# EasyEDA Pro project ProPrj_嵌赛国赛_2025-08-15.epro, board PCB6
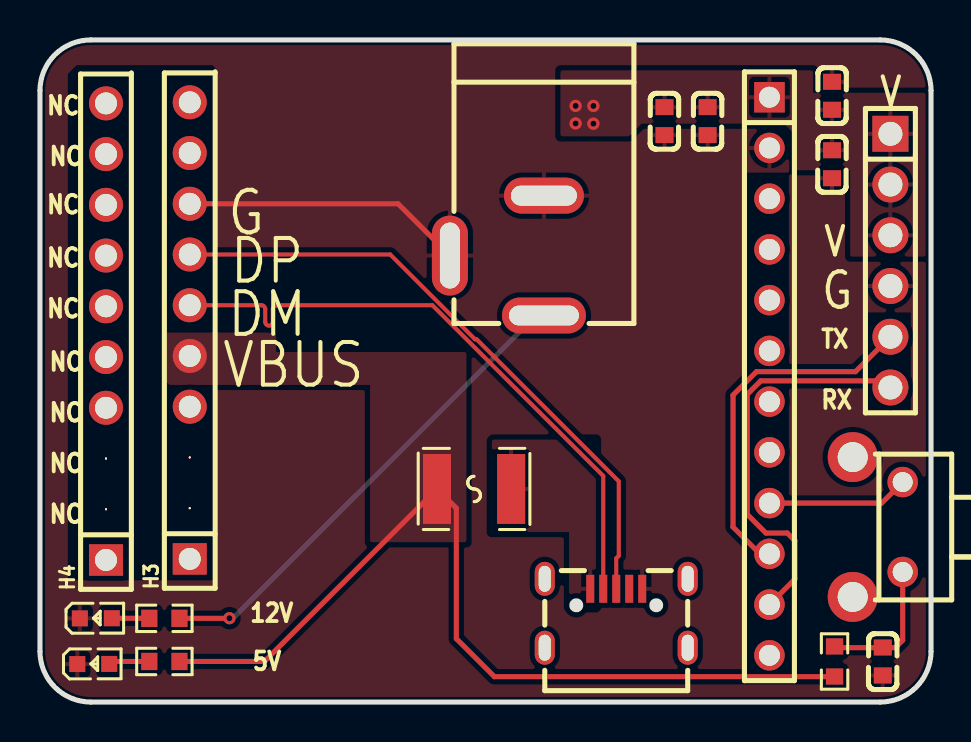
[diagram p16: board, top side]
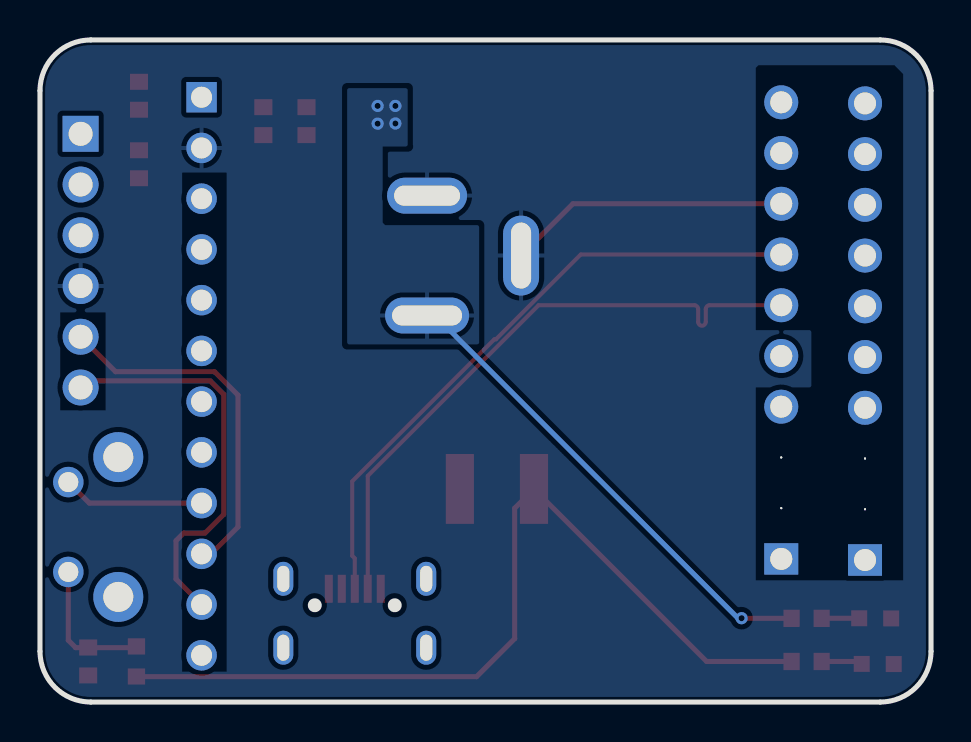
[diagram p17: board, bottom side, seen from below]

Outline 44.58 x 33.15 mm; copper layers: Top Layer, Bottom Layer. Coordinates in mm from the lower left corner of the outline.
Outline path: 0,30.61 0,2.54 arc(0.74,0.74) 2.54,0 42.04,0 arc(43.83,0.74) 44.58,2.54 44.58,30.61 arc(43.83,32.4) 42.04,33.15 2.54,33.15 arc(0.74,32.4) 0,30.61
Stack: Top Layer 0.035mm / Dielectric1 1.51mm FR4 er 4.5 / Bottom Layer 0.035mm

## Design rules (mm)
template: 自定义配置
spacing copperThickness1oz (default): track to track 0.102, other pairs 0.152 to 0.3
spacing copperThickness2oz: track to track 0.203, other pairs 0.152 to 0.3
track width copperThickness1oz (default): min 0.127, default 0.254, max 2.54
track width copperThickness2oz: min 0.203, default 0.254, max 2.54
differential pair differentialPair (default): width min 0.127, default 0.254, max 2.54; gap min 0.152, default 0.152
via viaSize (default): diameter min 0.5, default 0.61, max 10; hole min 0.3, default 0.305, max 6.3
net COMPUTER_VBUS uses 66

## Placement (name value [footprint] x y rotation side)
C1  100nF  [C0603]  33.4 29.08 90 top
C77  100nF  [C0603]  42.16 2.03 90 top
C78  10uf  [C0603]  31.24 29.08 90 top
C79  100nF  [C0603]  39.62 30.35 270 top
C80  10uf  [C0603]  39.62 26.92 90 top
DC1  DC-005-5A-2.0  [DC-IN-TH_DC-005-5A-2.0]  22.86 22.35 270 top
H2  PZ254V-11-12P  [HDR-TH_12P-P2.54-V-M]  36.49 16.31 270 top
H3  PZ254V-11-10P  [HDR-TH_10P-P2.54-V-M]  7.49 18.6 90 top
H4  PZ254V-11-10P  [HDR-TH_10P-P2.54-V-M]  3.3 18.54 90 top
H7  2.54-1x6P直针  [HDR-TH_6P-P2.54-V-M-1]  42.54 22.1 270 top
LED3  XL-1608SURC-06  [LED0603-RD_RED]  2.67 1.91 0 top
LED4  XL-1608SURC-06  [LED0603-RD_RED]  2.79 4.19 0 top
R5  10kΩ  [R0603]  6.22 2.03 180 top
R50  10kΩ  [R0603]  39.75 2.03 270 top
R51  10kΩ  [R0603]  6.22 4.19 180 top
SW18  TC-6615-5-260G  [SW-TH_4P-L7.5-W5.0-P4.50]  41.91 8.76 270 top
U41  MF-MSMF050-2  [F1812]  21.72 10.67 0 top
USB2  MICRO 4P DIP  [MINI-USB-SMD_MICRO-4P-DIP]  28.83 4.44 0 top

## Footprints (pads in the part's own frame, mm; a bottom-side part is the same pattern mirrored in y, then rotated)
C0603
  rect 0.8x0.9 smd: 1(-0.7,0) 2(0.7,0)
DC-IN-TH_DC-005-5A-2.0
  oval 1.8x4.2 hole 1x3.5: 1(3,2.352)
  oval 1.8x4 hole 1x3.3: 2(-3,2.352)
  oval 4x1.8 hole 3.3x1: 3(-0.001,-2.352)
F1812
  rect 1.407x3.499 smd: 1(-1.853,0) 2(1.853,0)
HDR-TH_6P-P2.54-V-M-1
  rect 1.8x1.8 hole 1.2: 1(-6.35,0)
  round 1.8 hole 1.2: 2(-3.81,0) 3(-1.27,0) 4(1.27,0) 5(3.81,0) 6(6.35,0)
HDR-TH_10P-P2.54-V-M
  rect 1.575x1.7 hole 1.1: 1(-11.43,0)
  round 0.1 hole 1.1x0.1: 2(-8.89,0) 3(-6.35,0)
  round 1.7 hole 1.1: 4(-3.81,0) 5(-1.27,0) 6(1.27,0) 7(3.81,0) 8(6.35,0) 9(8.89,0) 10(11.43,0)
HDR-TH_12P-P2.54-V-M
  rect 1.524x1.524 hole 1.05: 1(-13.97,0)
  round 1.524 hole 1.05: 2(-11.43,0) 3(-8.89,0) 4(-6.35,0) 5(-3.81,0) 6(-1.27,0) 7(1.27,0) 8(3.81,0) 9(6.35,0) 10(8.89,0) 11(11.43,0) 12(13.97,0)
LED0603-RD_RED
  rect 0.8x0.8 smd: 1(-0.799,-0.004) 2(0.799,0.004)
MINI-USB-SMD_MICRO-4P-DIP
  rect 0.4x1.4 smd: 1(-1.3,1.225) 2(-0.65,1.225) 3(0,1.225) 4(0.65,1.225) 5(1.3,1.225)
  oval 1x1.7 hole 0.6x1.3: 6(-3.575,1.725) 6(-3.575,-1.725) 6(3.575,1.725) 6(3.575,-1.725)
R0603
  rect 0.806x0.864 smd: 1(-0.753,0) 2(0.753,0)
SW-TH_4P-L7.5-W5.0-P4.50
  round 1.524 hole 1: 1(-2.25,1.25) 2(2.25,1.25)
  round 2.5 hole 1.5: 3(-3.5,-1.25) 4(3.5,-1.25)

## Nets
As in the schematic.

Pads without a net: H2 3 4 5 6 7 8 12; H3 1 2 3 4 9 10; H4 1 2 3 4 9 10; SW18 3 4; USB2 4 6

## Via types
v1: diameter 0.61, hole 0.305, Top Layer to Bottom Layer, 5 vias

## Routing (per net, layer and track width the routed paths; a pad name or vN(x,y) marks a point on that pad's centre or on a via; arc(x,y) is an arc through that point)
GND: length 14.1
  Top Layer w0.254: DC1.3 17.91,24.95 H3.8
VIN: length 24.5
  Top Layer w0.254: v1(9.48,4.2) 9.47,4.19 R51.1
  Bottom Layer w0.254: DC1.1 24.81,19.35 9.66,4.2 v1(9.48,4.2)
  vias: v1(26.8,29.84) v1(26.8,28.97) v1(27.69,29.84) v1(27.69,28.96)
COMPUTER_VBUS: length 44.1
  Top Layer w0.254: R5.1 11.23,2.03 U41.1 20.83,9.7 20.83,3.17 22.73,1.27 39.74,1.27 R50.2
DM: length 31.6
  Top Layer w0.203: 28.18,5.67 28.18,11.32 19.63,19.87 11.84,19.87 arc(11.71,19.81) 11.65,19.68 11.65,19.03 arc(11.46,18.84) 11.27,19.03 11.27,19.68 arc(11.21,19.81) 11.08,19.87 H3.6
DP: length 31.6
  Top Layer w0.203: H3.7 17.52,22.41 21.77,18.16 21.84,18.16 28.96,11.05 28.96,7.32 28.83,7.19 28.83,5.67
FOUR1_RX: length 20.3
  Top Layer w0.254: 36.49,4.88 37.77,6.16 37.77,8.08 37.39,8.46 36.32,8.46 35.38,9.4 35.38,15.4 36.06,16.08 42.21,16.08 H7.6
FOUR1_TX: length 18.1
  Top Layer w0.254: H2.10 36.01,7.42 34.67,8.76 34.67,15.37 35.84,16.54 40.8,16.54 H7.5
RST: length 7.1
  Top Layer w0.254: 36.49,9.96 42.11,9.96 SW18.1
$1N1239: length 6.6
  Top Layer w0.254: SW18.2 43.16,3.09 42.79,2.72 40.13,2.72
$1N2955: length 2.1
  Top Layer w0.254: R5.2 3.59,2.03 LED3.2
$1N3053: length 1.9
  Top Layer w0.254: LED4.2 5.47,4.19 R51.2

## Copper pours and planes (outline as drawn; the poured copper is in the pictures)
GND on Top Layer: -2.67,35.69 65.28,35.69 66.42,34.54 66.42,12.45 49.66,-4.32 -2.79,-4.32 -3.18,-3.94 -3.18,35.18
GND on Bottom Layer: -11.68,42.42 50.42,42.42 59.94,32.89 59.94,6.98 47.24,-5.71 -2.41,-5.71 -11.68,3.56
VIN on Top Layer: 44.3,22.3 44.3,30.5 38.67,30.5 38.67,31.62 26.04,31.62 26.03,31.61 26.03,28.32 29.46,28.32 30.1,28.96 37.22,28.96 37.74,28.44 37.74,26.63 40.53,26.63 40.53,22.37 40.53,22.3
VIN on Bottom Layer: 22.61,17.91 29.21,17.91 29.21,30.73 26.18,30.73 26.18,27.83 26.16,27.81 27.43,27.81 27.43,24 27.31,23.88 22.61,23.88
COMPUTER_VBUS on Top Layer: 6.22,18.47 6.22,16.13 6.48,15.88 16.51,15.88 16.51,8 21.34,8 21.34,17.53 11.81,17.53 11.81,18.5 6.25,18.5
$1N802 on Top Layer: 22.61,13.08 22.61,8.51 26.47,8.51 26.47,4.74 27.81,4.74 27.81,13.14 22.67,13.14

## Text on the board
Top Silkscreen Layer: NC | 12V | 5V | TX | RX | V | G | VBUS | DM | DP
